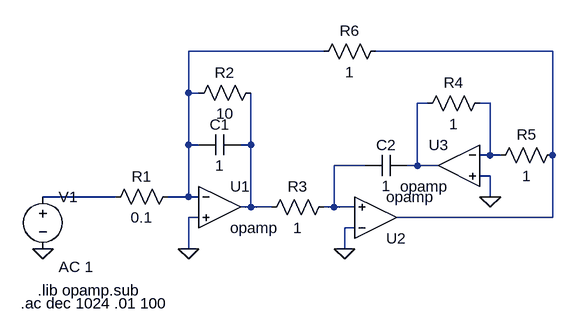
[diagram p0: schematic Draft1.asc]
Draft1.asc, the LTspice schematic file:
Version 4
SHEET 1 880 680
WIRE 224 -128 16 -128
WIRE 576 -128 304 -128
WIRE 16 -64 16 -128
WIRE 32 -64 16 -64
WIRE 384 -48 368 -48
WIRE 480 -48 464 -48
WIRE 16 16 16 -64
WIRE 32 16 16 16
WIRE 112 16 112 -64
WIRE 112 16 96 16
WIRE 480 32 480 -48
WIRE 480 32 464 32
WIRE 496 32 480 32
WIRE 576 32 576 -128
WIRE 288 48 240 48
WIRE 368 48 368 -48
WIRE 368 48 352 48
WIRE 400 48 368 48
WIRE 480 64 464 64
WIRE -96 96 -208 96
WIRE 16 96 16 16
WIRE 16 96 -16 96
WIRE 32 96 16 96
WIRE 480 96 480 64
WIRE 112 112 112 16
WIRE 112 112 96 112
WIRE 144 112 112 112
WIRE 240 112 240 48
WIRE 240 112 224 112
WIRE 272 112 240 112
WIRE 32 128 16 128
WIRE 576 128 576 32
WIRE 576 128 336 128
WIRE 272 144 256 144
WIRE 16 176 16 128
WIRE 256 176 256 144
FLAG 16 176 0
FLAG 256 176 0
FLAG -208 176 0
FLAG 480 96 0
SYMBOL OpAmps\\opamp 64 48 R0
SYMATTR InstName U1
SYMBOL OpAmps\\opamp 304 192 M180
SYMATTR InstName U2
SYMBOL OpAmps\\opamp 432 -16 M0
SYMATTR InstName U3
SYMBOL res 0 80 R90
WINDOW 0 0 56 VBottom 2
WINDOW 3 32 56 VTop 2
SYMATTR InstName R1
SYMATTR Value 0.1
SYMBOL res 128 -80 R90
WINDOW 0 0 56 VBottom 2
WINDOW 3 32 56 VTop 2
SYMATTR InstName R2
SYMATTR Value 10
SYMBOL cap 96 0 R90
WINDOW 0 0 32 VBottom 2
WINDOW 3 32 32 VTop 2
SYMATTR InstName C1
SYMATTR Value 1
SYMBOL res 240 96 R90
WINDOW 0 0 56 VBottom 2
WINDOW 3 32 56 VTop 2
SYMATTR InstName R3
SYMATTR Value 1
SYMBOL cap 352 32 R90
WINDOW 0 0 32 VBottom 2
WINDOW 3 32 32 VTop 2
SYMATTR InstName C2
SYMATTR Value 1
SYMBOL res 480 -64 R90
WINDOW 0 0 56 VBottom 2
WINDOW 3 32 56 VTop 2
SYMATTR InstName R4
SYMATTR Value 1
SYMBOL res 592 16 R90
WINDOW 0 0 56 VBottom 2
WINDOW 3 32 56 VTop 2
SYMATTR InstName R5
SYMATTR Value 1
SYMBOL res 320 -144 R90
WINDOW 0 0 56 VBottom 2
WINDOW 3 32 56 VTop 2
SYMATTR InstName R6
SYMATTR Value 1
SYMBOL voltage -208 80 R0
WINDOW 123 24 124 Left 2
WINDOW 39 0 0 Left 0
SYMATTR InstName V1
SYMATTR Value ""
SYMATTR Value2 AC 1
TEXT -216 240 Left 2 !.lib opamp.sub
TEXT -242 260 Left 2 !.ac dec 1024 .01 100

The netlist it stands for:
* Draft1.asc
XU1 N001 0 N005 opamp Aol=100K GBW=10Meg  ; pins invin noninvin out
XU2 0 N006 N002 opamp Aol=100K GBW=10Meg  ; pins invin noninvin out
XU3 N004 0 N003 opamp Aol=100K GBW=10Meg  ; pins invin noninvin out
R1 N001 N007 0.1
R2 N005 N001 10
C1 N005 N001 1
R3 N006 N005 1
C2 N003 N006 1
R4 N004 N003 1
R5 N002 N004 1
R6 N002 N001 1
V1 N007 0 AC 1
.lib opamp.sub
.ac dec 1024 .01 100
.backanno
.end